# Altium schematic sheet Schematic_Drohne.SchDoc
size A4; DocumentNumber: 1; Revision: 0.1; SheetNumber: 1; SheetTotal: 1; HTL_Gruppe: I; HTL_Zusaetzlicher_Titel: Schematic PCB Drohne; HTL_Schueler_Name: Exenberger Matthias; PageSetup: Record=PageOptions|CenterHorizontal=True|CenterVertical=True|PrintScale=1.00|XCorrection=1.00|YCorrection=1.00|PrintKind=0|BorderSize=5000000|LeftOffset=0|BottomOffset=0|Orientation=2|PaperLength=1000|PaperWidth=1000|Scale=100|PaperSource=7|PrintQuality=-4|MediaType=1|DitherType=10|PaperKind=A4|PrintScaleMode=1; HTL_Projektname: R6 Drohne; HTL_Dokumentenart: Dokumentenart; HTL_Dokumentenstatus: Dokumentenstatus; SPICEModelCacheNLBSCCMY: <root> / <DocumentId>NLBSCCMY</DocumentId> / <CacheFrame Number="0"> / <Model Name="bzx55c3v3" Kind="CKT"> / <Text>*BZX55C3V3 MCE 4/7/98 / *Ref: Temic Semiconductor Short Form, 1996 / *3.3V 500mW Si Zener pkg:Diode0.4 1,2 / .SUBCKT BZX55C3V3 1 2 / *    TERMINALS:  A K / D1 1 2  DF / DZ 3 1  DR / VZ 2 3  2.791 / .MODEL DF D (IS=2.51N RS=84M N=1.7 CJO=182P VJ=0.75 M=0.33 TT=50.1N) / .MODEL DR D (IS=145F RS=1.77 N=0.8) / .ENDS</Text> / </Model> / </CacheFrame> / </root>
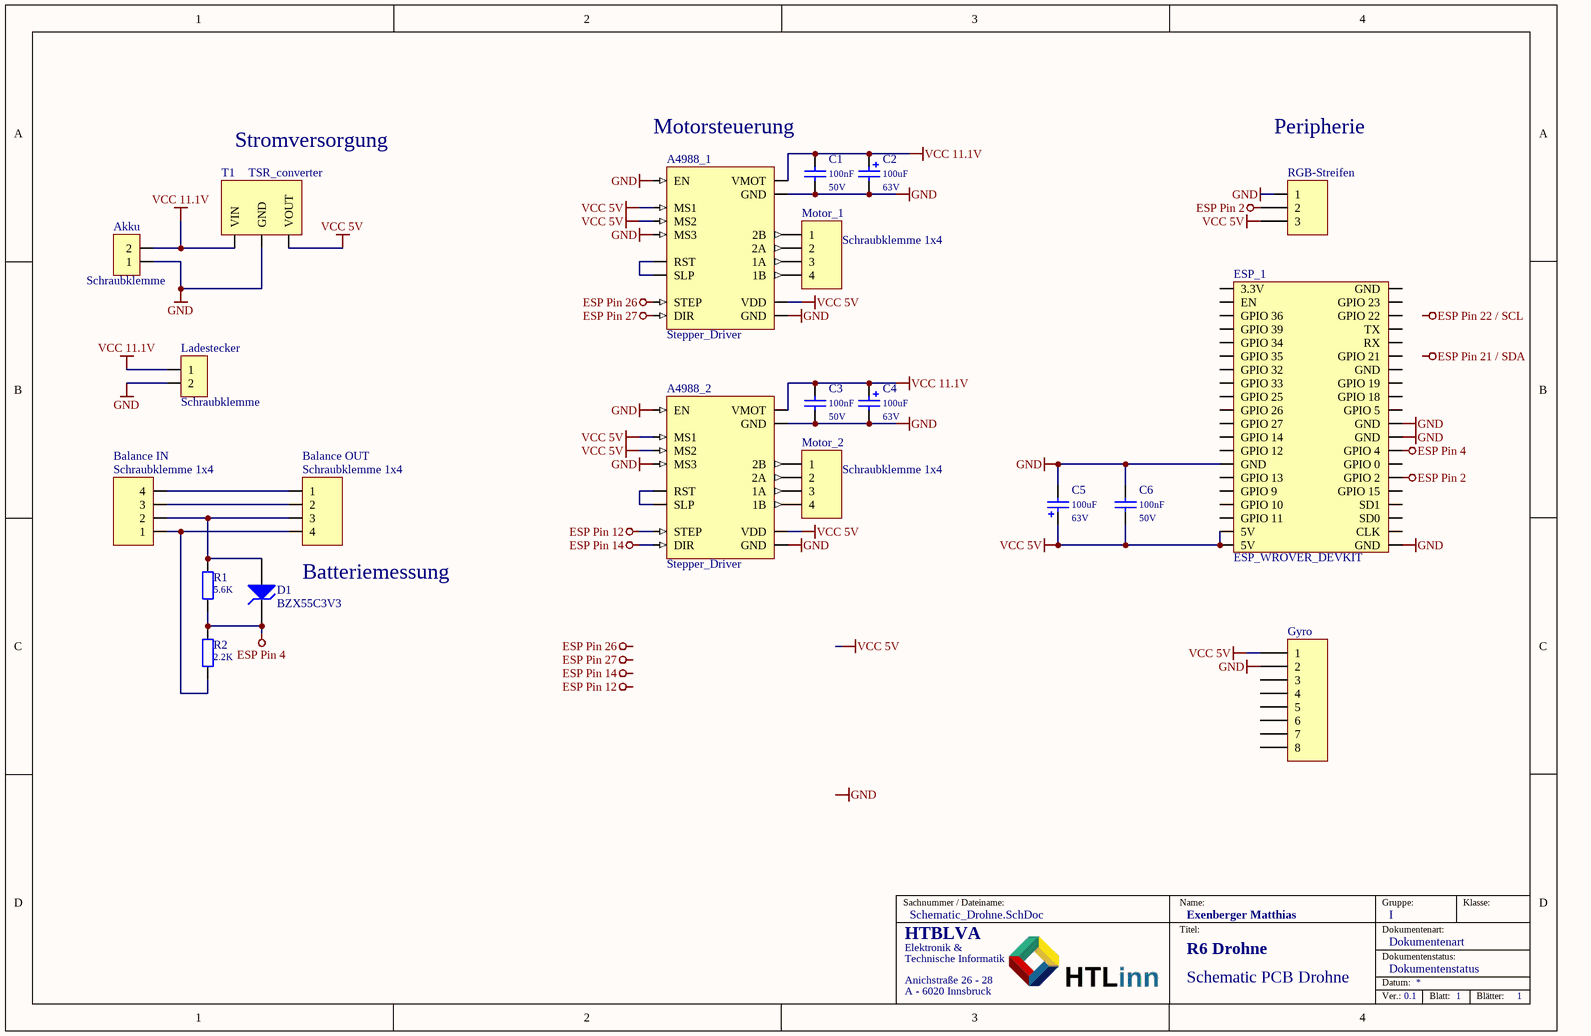
[diagram p0: Schematic_Drohne.SchDoc]

## Parts
A4988_1  Stepper_Driver  [A4988]
A4988_2  Stepper_Driver  [A4988]
Akku  Schraubklemme  [Schraubklemme_1x2]
Balance_IN  Schraubklemme 1x4  [CTB0502-4]
Balance_OUT  Schraubklemme 1x4  [CTB0502-4]
C1  Rated Voltage: 50V  [C_RM2-025X075 - with Ceramic Disc Capacitor]  (hidden comment: 100nF)
C2  Rated Voltage: 63V  [C_POL_RM2-10,5 x 12.5mm]  (hidden comment: 100uF)
C3  Rated Voltage: 50V  [C_RM2-025X075 - with Ceramic Disc Capacitor]  (hidden comment: 100nF)
C4  Rated Voltage: 63V  [C_POL_RM2-10,5 x 12.5mm]  (hidden comment: 100uF)
C5  Rated Voltage: 63V  [C_POL_RM2-10,5 x 12.5mm]  (hidden comment: 100uF)
C6  Rated Voltage: 50V  [C_RM2-025X075 - with Ceramic Disc Capacitor]  (hidden comment: 100nF)
D1  BZX55C3V3  [D_DO35-RM3]
ESP_1  ESP_WROVER_DEVKIT  [ESP_WROVER_DEVKIT]
Gyro  Header 8  [HDR1X8]  (value not drawn)
Ladestecker  Schraubklemme  [Schraubklemme_1x2]
Motor_1  Schraubklemme 1x4  [CTB0502-4]
Motor_2  Schraubklemme 1x4  [CTB0502-4]
R1  5.6K  [R_0204V/RM1 - 1k]
R2  2.2K  [R_0204V/RM1 - 1k]
RGB-Streifen  (no value)  [HDR1X3]
T1  TSR_converter  [PCBComponent_1]

## Nets
ESP Pin 2: ESP_1.35(GPIO_2) RGB-Streifen.2
ESP Pin 4: D1.2(K) ESP_1.33(GPIO_4) R1.2 R2.1
ESP Pin 12: A4988_2.7(STEP)
ESP Pin 14: A4988_2.8(DIR)
ESP Pin 26: A4988_1.7(STEP)
ESP Pin 27: A4988_1.8(DIR)
GND: A4988_1.1(EN) A4988_1.4(MS3) A4988_1.10(GND) A4988_1.16(GND) A4988_2.1(EN) A4988_2.4(MS3) A4988_2.10(GND) A4988_2.16(GND) Akku.1 C1.1 C2.2(-) C3.1 C4.2(-) C5.2(-) C6.2 ESP_1.14(GND) ESP_1.31(GND) ESP_1.32(GND) ESP_1.40(GND) Gyro.2 Ladestecker.2 RGB-Streifen.1 T1.2(GND)
VCC 5V: A4988_1.2(MS1) A4988_1.3(MS2) A4988_1.15(VDD) A4988_2.2(MS1) A4988_2.3(MS2) A4988_2.15(VDD) C5.1(+) C6.1 ESP_1.19(5V) ESP_1.20(5V) Gyro.1 RGB-Streifen.3 T1.3(VOUT)
VCC 11.1V: A4988_1.9(VMOT) A4988_2.9(VMOT) Akku.2 C1.2 C2.1(+) C3.2 C4.1(+) Ladestecker.1 T1.1(VIN)
NetA4988_1_5: A4988_1.5(RST) A4988_1.6(SLP)
NetA4988_1_11: A4988_1.11(2B) Motor_1.1
NetA4988_1_12: A4988_1.12(2A) Motor_1.2
NetA4988_1_13: A4988_1.13(1A) Motor_1.3
NetA4988_1_14: A4988_1.14(1B) Motor_1.4
NetA4988_2_5: A4988_2.5(RST) A4988_2.6(SLP)
NetA4988_2_11: A4988_2.11(2B) Motor_2.1
NetA4988_2_12: A4988_2.12(2A) Motor_2.2
NetA4988_2_13: A4988_2.13(1A) Motor_2.3
NetA4988_2_14: A4988_2.14(1B) Motor_2.4
NetBalance_IN_1: Balance_IN.1 Balance_OUT.4 R2.2
NetBalance_IN_2: Balance_IN.2 Balance_OUT.3 D1.1(A) R1.1
NetBalance_IN_3: Balance_IN.3 Balance_OUT.2
NetBalance_IN_4: Balance_IN.4 Balance_OUT.1

Not connected (* = marked no-connect by the designer): ESP_1 1(3.3V) 2(EN) 3(GPIO_36) 4(GPIO_39) 5(GPIO_34) 6(GPIO_35) 7(GPIO_32) 8(GPIO_33) 9(GPIO_25) 10(GPIO_26) 11(GPIO_27) 12(GPIO_14) 13(GPIO_12) 15(GPIO_13) 16(GPIO_9) 17(GPIO_10) 18(GPIO_11) 21(GND) 22(GPIO_23) 23(GPIO_22) 24(TX) 25(RX) 26(GPIO_21) 27(GND) 28(GPIO_19) 29(GPIO_18) 30(GPIO_5) 34(GPIO_0) 36(GPIO_15) 37(SD1) 38(SD0) 39(CLK); Gyro 3 4 5 6 7 8

## Notes on the sheet
- Stromversorgung
- Motorsteuerung
- Peripherie
- Batteriemessung
- Labels drawn without touching a wire or pin: ESP Pin 12, ESP Pin 14, ESP Pin 21 / SDA, ESP Pin 22 / SCL, ESP Pin 26, ESP Pin 27, GND
- Sachnummer / Dateiname:
- Name:
- Gruppe:
- Klasse:
- Elektronik &
- Technische Informatik
- Anichstraße 26 - 28
- HTBLVA
- Titel:
- Datum:
- Dokumentenart:
- Dokumentenstatus:
- A - 6020 Innsbruck
- Ver.:
- Blatt:
- Blätter:

## Library data of the parts
Akku Ladestecker = Schraubklemme_1x2
C1 C3 C6 = C: Capacitor; Usage: only permitted for non-commercial purposes at HTL I Innsbruck; Published: 21-Feb-2011; LatestRevisionDate: 07-Sep-2019; Value: 100nF
C2 C4 C5 = C_POL: Polarized Capacitor; Usage: only permitted for non-commercial purposes at HTL I Innsbruck; Published: 21-Feb-2011; LatestRevisionDate: 07-Sep-2019; Value: 100uF
D1 = BZX55C3V3: Zener Diode 3.3V, 500mW (Silicon Epitaxial Planar); pin to pad: 1>A 2>C; Usage: only permitted for non-commercial purposes at HTL I Innsbruck; SimulationModellSource: Vishay Telefunken Discrete Diode; Published: 04-Jun-2011; LatestRevisionDate: 01-Nov-2012; Publisher: Michael Kupfner
Gyro = Header 8: Header, 8-Pin; LatestRevisionDate: 17-Jul-2002; LatestRevisionNote: Re-released for DXP Platform.; Publisher: Altium Limited
R1 R2 = R: Resistor; Usage: only permitted for non-commercial purposes at HTL I Innsbruck; Published: 21-Feb-2011; LatestRevisionDate: 07-Sep-2019
  R1: Value: 5.6K
  R2: Value: 2.2K
RGB-Streifen = Header 3: Header, 3-Pin; LatestRevisionDate: 17-Jul-2002; LatestRevisionNote: Re-released for DXP Platform.; Publisher: Altium Limited
T1 = TSR-0-5-2450